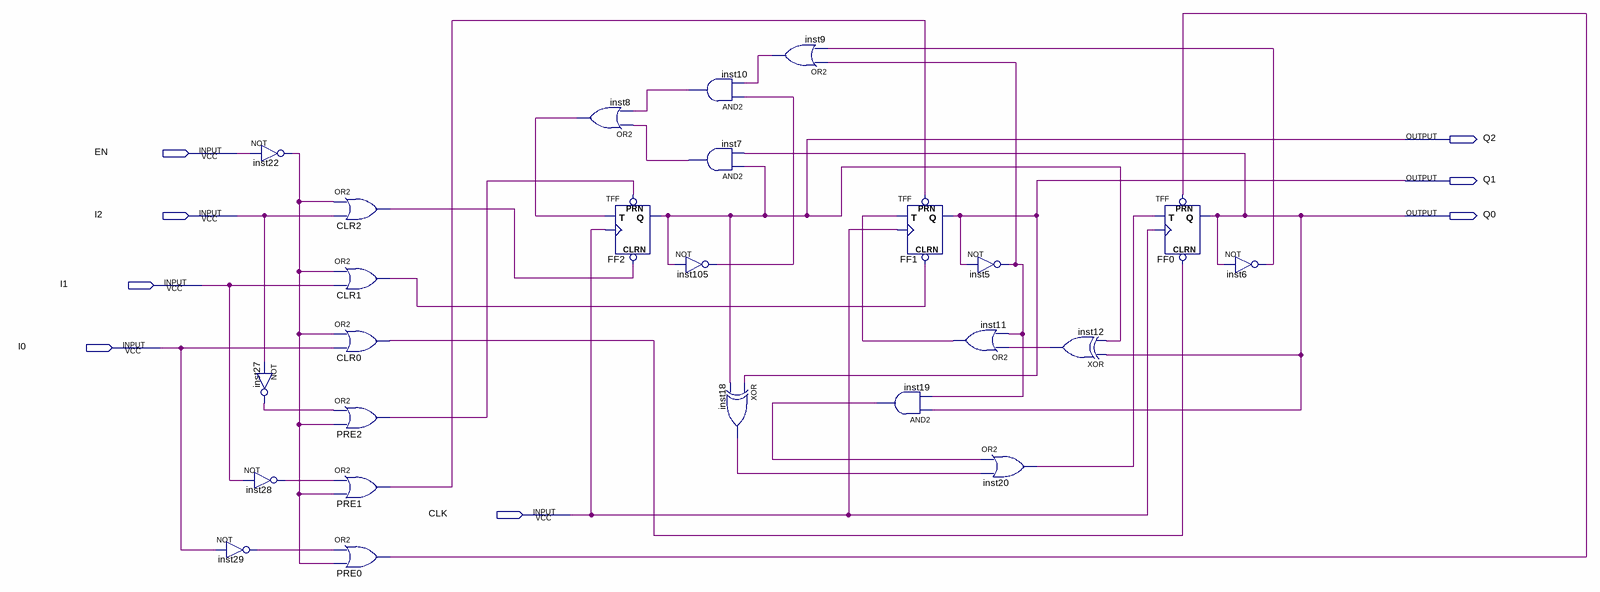
[diagram p0: schematic sheet]
// Quartus schematic design.bdf as structural Verilog: 25 symbols, 8 pins
module \design  (
  input  EN,
  input  I2,
  input  I1,
  input  I0,
  input  CLK,
  output Q2,
  output Q1,
  output Q0
);

  wire CLR0_out, CLR1_out, CLR2_out, inst5_out, inst6_out, inst7_out, inst8_out, inst9_out, inst10_out,
       inst11_out, inst12_out, inst18_out, inst19_out, inst20_out, inst22_out, inst27_out, inst28_out,
       inst29_out, inst105_out, PRE0_out, PRE1_out, PRE2_out;

  not inst22 (inst22_out, EN);
  not inst27 (inst27_out, I2);
  not inst28 (inst28_out, I1);
  not inst29 (inst29_out, I0);
  or CLR2 (CLR2_out, inst22_out, I2);
  or CLR1 (CLR1_out, inst22_out, I1);
  or CLR0 (CLR0_out, inst22_out, I0);
  or PRE2 (PRE2_out, inst27_out, inst22_out);
  or PRE1 (PRE1_out, inst28_out, inst22_out);
  or PRE0 (PRE0_out, inst29_out, inst22_out);
  or inst8 (inst8_out, inst7_out, inst10_out);
  TFF FF2 (.PRN(PRE2_out), .CLRN(CLR2_out), .T(inst8_out), .CLK(CLK), .Q(Q2));
  and inst10 (inst10_out, inst105_out, inst9_out);
  and inst7 (inst7_out, Q2, Q0);
  not inst105 (inst105_out, Q2);
  xor inst18 (inst18_out, Q1, Q2);
  or inst9 (inst9_out, inst5_out, inst6_out);
  and inst19 (inst19_out, Q0, inst5_out);
  TFF FF1 (.PRN(PRE1_out), .CLRN(CLR1_out), .T(inst11_out), .CLK(CLK), .Q(Q1));
  not inst5 (inst5_out, Q1);
  or inst11 (inst11_out, inst12_out, inst5_out);
  or inst20 (inst20_out, inst19_out, inst18_out);
  xor inst12 (inst12_out, Q0, Q2);
  TFF FF0 (.PRN(PRE0_out), .CLRN(CLR0_out), .T(inst20_out), .CLK(CLK), .Q(Q0));
  not inst6 (inst6_out, Q0);
endmodule
